# Altium schematic sheet Sch_LCD.SchDoc: Control de Domótica
size A4; Author: González González, Francisco - Ipar, Eugenia; CompanyName: Conexión Display LCD; DocumentNumber: 9; SheetNumber: 9; SheetTotal: 12; Prof1: Prof: Alarcón, Juan; Prof2: Ayud: Crivelli, Marcelo; Prof3: Ayud: Montalti, Pablo; Materia: Técnicas Digitales II; Proyecto: Control de Domótica; Year: 2015; ProjectName: Control de Domótica
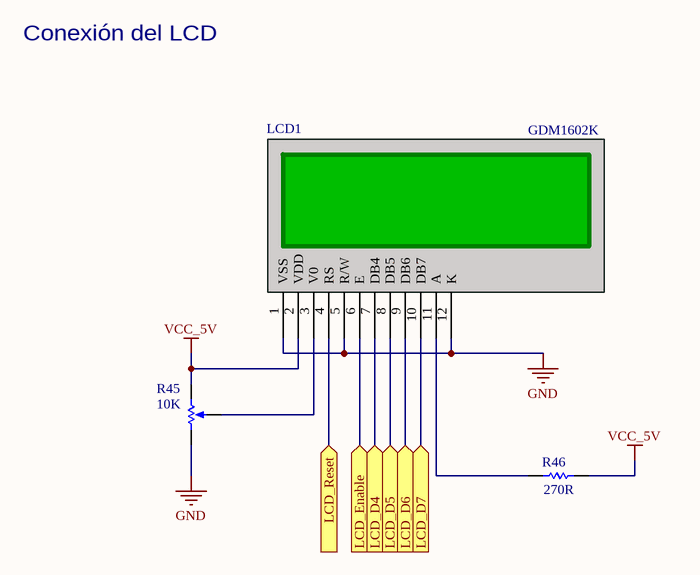
[diagram p0: Sch_LCD.SchDoc]

## Parts
LCD1  GDM1602K  [LCD]
R45  value 10K  [VR5]  (hidden comment: RPot)
R46  value 270R  [AXIAL-0.3]  (hidden comment: Res1)

## Ports
LCD_D4 (in), LCD_D5 (in), LCD_D6 (in), LCD_D7 (in), LCD_Enable (in), LCD_Reset (in)

## Nets
GND: LCD1.1(VSS) LCD1.5(R/W) LCD1.12(K) R45.1(TOP)
VCC_5V: LCD1.2(VDD) R45.2(BOT) R46.2
LCD_D4: LCD1.7(DB4) ; port LCD_D4
LCD_D5: LCD1.8(DB5) ; port LCD_D5
LCD_D6: LCD1.9(DB6) ; port LCD_D6
LCD_D7: LCD1.10(DB7) ; port LCD_D7
LCD_Enable: LCD1.6(E) ; port LCD_Enable
LCD_Reset: LCD1.4(RS) ; port LCD_Reset
NetLCD1_3: LCD1.3(V0) R45.3(TAP)
NetLCD1_11: LCD1.11(A) R46.1

## Notes on the sheet
- Conexión del LCD
- Sheet
- of

## Library data of the parts
LCD1 = LCD: LCD GDM1602K Rev2.2
R45 = RPot: Potentiometer; Sim Note: Enter the Resistance value and the set point into parameter fields.; Set Position: 0.5; Published: 8-Jun-2000; LatestRevisionDate: 17-Jul-2002; LatestRevisionNote: Re-released for DXP Platform.; PackageReference: VR5; Publisher: Altium Limited; PackageDescription: Variable Resistor, Thru-Hole; 3 Leads
R46 = Res1: Resistor; Published: 8-Jun-2000; LatestRevisionDate: 17-Jul-2002; LatestRevisionNote: Re-released for DXP Platform.; PackageReference: AXIAL-0.3; Publisher: Altium Limited; PackageDescription: Axial Device, Thru-Hole; 2 Leads; 0.3 in Pin Spacing